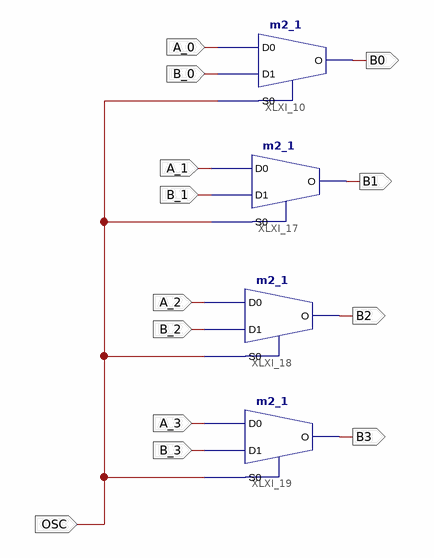
[diagram p0: schematic sheet 1]
// Xilinx ISE schematic Mux.sch (spartan6) as structural Verilog: 4 symbols, 13 ports
module Mux (
  input  OSC,
  input  A_0,
  input  A_1,
  input  A_2,
  input  A_3,
  input  B_0,
  input  B_1,
  input  B_2,
  input  B_3,
  output B0,
  output B1,
  output B2,
  output B3
);

  m2_1 XLXI_10 (.D0(A_0), .D1(B_0), .S0(OSC), .O(B0));
  m2_1 XLXI_17 (.D0(A_1), .D1(B_1), .S0(OSC), .O(B1));
  m2_1 XLXI_19 (.D0(A_3), .D1(B_3), .S0(OSC), .O(B3));
  m2_1 XLXI_18 (.D0(A_2), .D1(B_2), .S0(OSC), .O(B2));

  // Notes on the sheet:
  //   LOC on signal B0 = P82
  //   LOC on signal B1 = P81
  //   LOC on signal B2 = P80
  //   LOC on signal B3 = P79
  //   LOC on signal OSC = P123
endmodule
